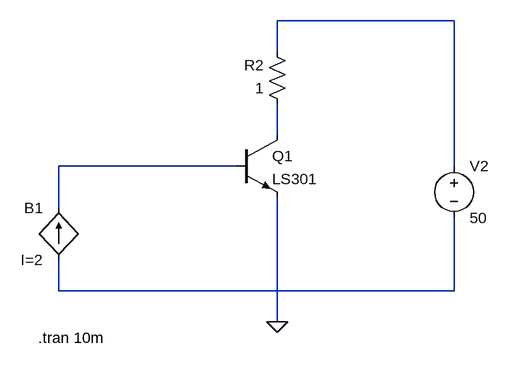
[diagram p0: schematic sw-circuit_1.asc]
sw-circuit_1.asc, the LTspice schematic file:
Version 4.1
SHEET 1 880 680
WIRE 448 -128 176 -128
WIRE 176 -80 176 -128
WIRE 176 48 176 0
WIRE 112 96 -160 96
WIRE 448 96 448 -128
WIRE -160 160 -160 96
WIRE -160 288 -160 240
WIRE 448 288 448 176
WIRE 448 288 -160 288
WIRE 176 336 176 144
FLAG 176 336 0
SYMBOL res 192 16 R180
WINDOW 0 36 76 Left 2
WINDOW 3 36 40 Left 2
SYMATTR InstName R2
SYMATTR Value 1
SYMBOL npn 112 48 R0
SYMATTR InstName Q1
SYMATTR Value LS301
SYMBOL voltage 448 80 R0
WINDOW 123 0 0 Left 0
WINDOW 39 0 0 Left 0
SYMATTR InstName V2
SYMATTR Value 50
SYMBOL bi -160 240 R180
WINDOW 0 24 80 Left 2
WINDOW 3 24 0 Left 2
SYMATTR InstName B1
SYMATTR Value I=2
TEXT -192 360 Left 2 !.tran 10m

The netlist it stands for:
* sw-circuit_1.asc
R2 N002 N001 1
Q1 N002 N003 0 0 LS301
V2 N001 N004 50
B1 N004 N003 I=2
.model NPN NPN
.model PNP PNP
.lib standard.bjt
.tran 10m
.backanno
.end